# EAGLE schematic wireless (EAGLE 9.2.2)

## Sheet 1 of 3: Microcontroller
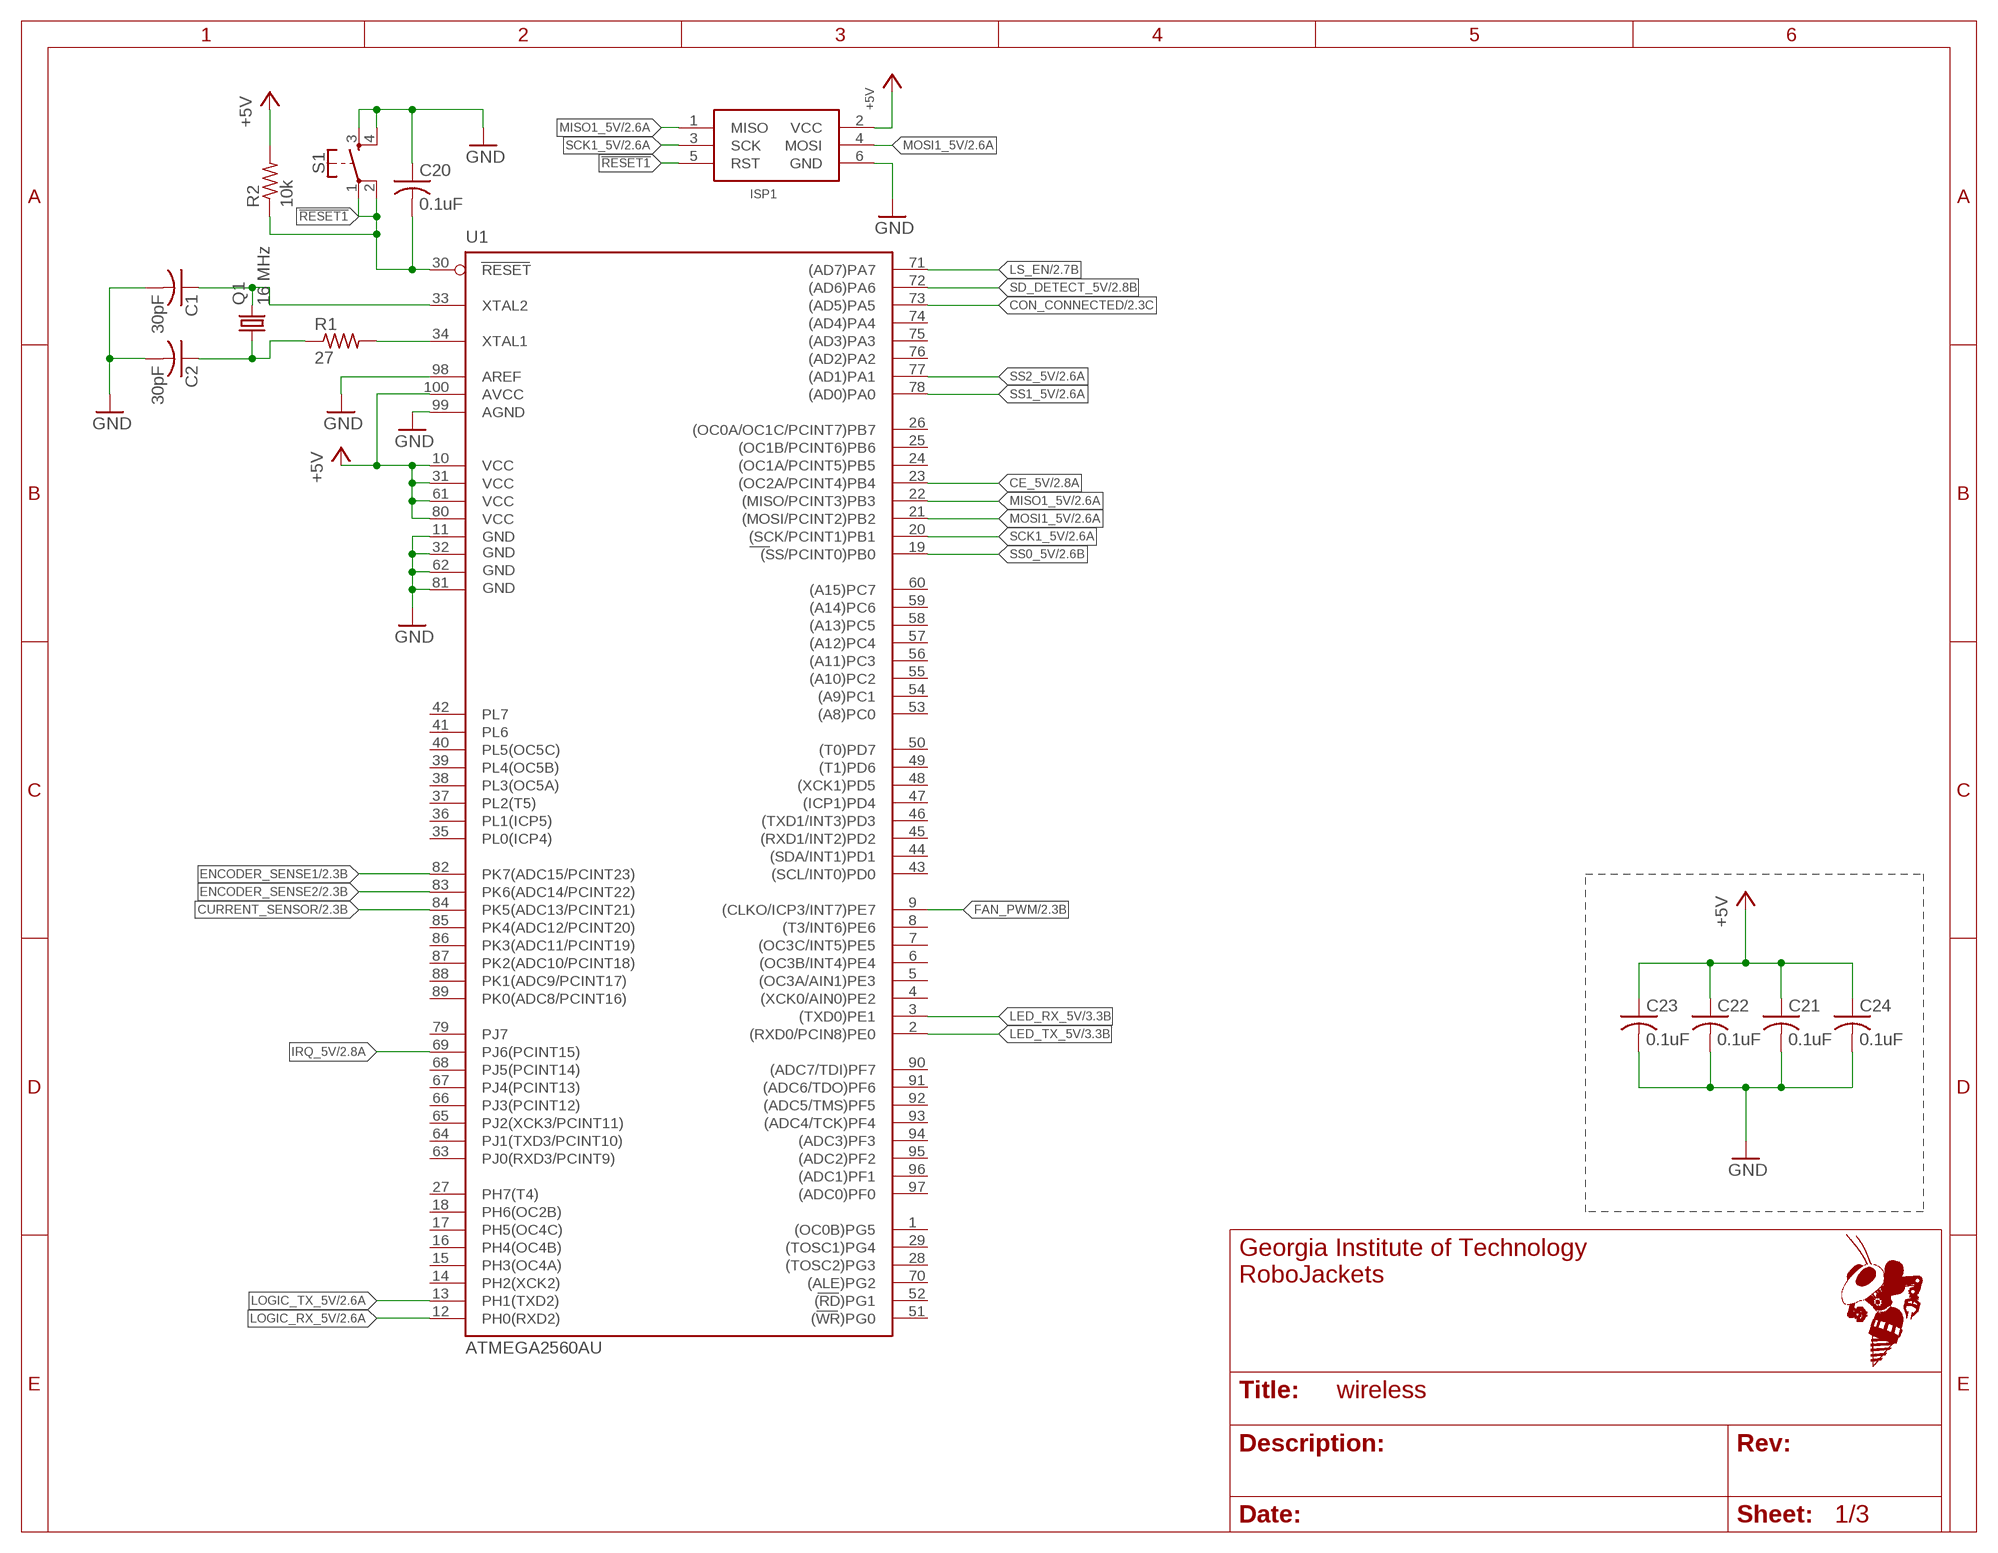
[diagram p0: schematic, sheet 1]

### Parts
C1  30pF  C-USC0603  [C0603]
C2  30pF  C-USC0603  [C0603]
C20  0.1uF  C-USC0603  [C0603]
C21  0.1uF  C-USC0603  [C0603]
C22  0.1uF  C-USC0603  [C0603]
C23  0.1uF  C-USC0603  [C0603]
C24  0.1uF  C-USC0603  [C0603]
ISP1  AVRISP-6  [AVRISP]
Q1  16 MHz  CRYSTALHC49UP  [HC49UP]
R1  27  R-US_R0603  [R0603]
R2  10k  R-US_R0603  [R0603]
S1  MOMENTARY-SWITCH-SPST-2-SMD-5.2MM  [TACTILE_SWITCH_SMD_5.2MM]
U1  ATMEGA2560AU  [TQFP100]

### Nets
!RESET1: C20.2 ISP1.5(RST) R2.1 S1.1 S1.2 U1.30(RESET)
+5V: C21.1 C22.1 C23.1 C24.1 ISP1.2(VCC) R2.2 U1.10(VCC) U1.31(VCC1) U1.61(VCC2) U1.80(VCC3) U1.100(AVCC) ; also sheet 2,3
CE_5V: U1.23((OC2A/PCINT4)PB4) ; also sheet 2
CON_CONNECTED: U1.73((AD5)PA5) ; also sheet 2
CURRENT_SENSOR: U1.84(PK5(ADC13/PCINT21)) ; also sheet 2
ENCODER_SENSE1: U1.82(PK7(ADC15/PCINT23)) ; also sheet 2
ENCODER_SENSE2: U1.83(PK6(ADC14/PCINT22)) ; also sheet 2
FAN_PWM: U1.9((CLKO/ICP3/INT7)PE7) ; also sheet 2
GND: C1.2 C2.2 C20.1 C21.2 C22.2 C23.2 C24.2 ISP1.6(GND) S1.3 S1.4 U1.11(GND) U1.32(GND1) U1.62(GND2) U1.81(GND3) U1.98(AREF) U1.99(AGND) ; also sheet 2,3
IRQ_5V: U1.69(PJ6(PCINT15)) ; also sheet 2
LED_RX_5V: U1.3((TXD0)PE1) ; also sheet 3
LED_TX_5V: U1.2((RXD0/PCIN8)PE0) ; also sheet 3
LOGIC_RX_5V: U1.12(PH0(RXD2)) ; also sheet 2
LOGIC_TX_5V: U1.13(PH1(TXD2)) ; also sheet 2
LS_EN: U1.71((AD7)PA7) ; also sheet 2
MISO1_5V: ISP1.1(MISO) U1.22((MISO/PCINT3)PB3) ; also sheet 2
MOSI1_5V: ISP1.4(MOSI) U1.21((MOSI/PCINT2)PB2) ; also sheet 2
N$1: C2.1 Q1.1 R1.1
N$2: C1.1 Q1.2 U1.33(XTAL2)
N$3: R1.2 U1.34(XTAL1)
SCK1_5V: ISP1.3(SCK) U1.20((SCK/PCINT1)PB1) ; also sheet 2
SD_DETECT_5V: U1.72((AD6)PA6) ; also sheet 2
SS0_5V: U1.19((SS/PCINT0)PB0) ; also sheet 2
SS1_5V: U1.78((AD0)PA0) ; also sheet 2
SS2_5V: U1.77((AD1)PA1) ; also sheet 2
Unconnected: U1.1((OC0B)PG5) U1.4((XCK0/AIN0)PE2) U1.5((OC3A/AIN1)PE3) U1.6((OC3B/INT4)PE4) U1.7((OC3C/INT5)PE5) U1.8((T3/INT6)PE6) U1.14(PH2(XCK2)) U1.15(PH3(OC4A)) U1.16(PH4(OC4B)) U1.17(PH5(OC4C)) U1.18(PH6(OC2B)) U1.24((OC1A/PCINT5)PB5) U1.25((OC1B/PCINT6)PB6) U1.26((OC0A/OC1C/PCINT7)PB7) U1.27(PH7(T4)) U1.28((TOSC2)PG3) U1.29((TOSC1)PG4) U1.35(PL0(ICP4)) U1.36(PL1(ICP5)) U1.37(PL2(T5)) U1.38(PL3(OC5A)) U1.39(PL4(OC5B)) U1.40(PL5(OC5C)) U1.41(PL6) U1.42(PL7) U1.43((SCL/INT0)PD0) U1.44((SDA/INT1)PD1) U1.45((RXD1/INT2)PD2) U1.46((TXD1/INT3)PD3) U1.47((ICP1)PD4) U1.48((XCK1)PD5) U1.49((T1)PD6) U1.50((T0)PD7) U1.51((WR)PG0) U1.52((RD)PG1) U1.53((A8)PC0) U1.54((A9)PC1) U1.55((A10)PC2) U1.56((A11)PC3) U1.57((A12)PC4) U1.58((A13)PC5) U1.59((A14)PC6) U1.60((A15)PC7) U1.63(PJ0(RXD3/PCINT9)) U1.64(PJ1(TXD3/PCINT10)) U1.65(PJ2(XCK3/PCINT11)) U1.66(PJ3(PCINT12)) U1.67(PJ4(PCINT13)) U1.68(PJ5(PCINT14)) U1.70((ALE)PG2) U1.74((AD4)PA4) U1.75((AD3)PA3) U1.76((AD2)PA2) U1.79(PJ7) U1.85(PK4(ADC12/PCINT20)) U1.86(PK3(ADC11/PCINT19)) U1.87(PK2(ADC10/PCINT18)) U1.88(PK1(ADC9/PCINT17)) U1.89(PK0(ADC8/PCINT16)) U1.90((ADC7/TDI)PF7) U1.91((ADC6/TDO)PF6) U1.92((ADC5/TMS)PF5) U1.93((ADC4/TCK)PF4) U1.94((ADC3)PF3) U1.95((ADC2)PF2) U1.96((ADC1)PF1) U1.97((ADC0)PF0)

## Sheet 2 of 3: Connectors
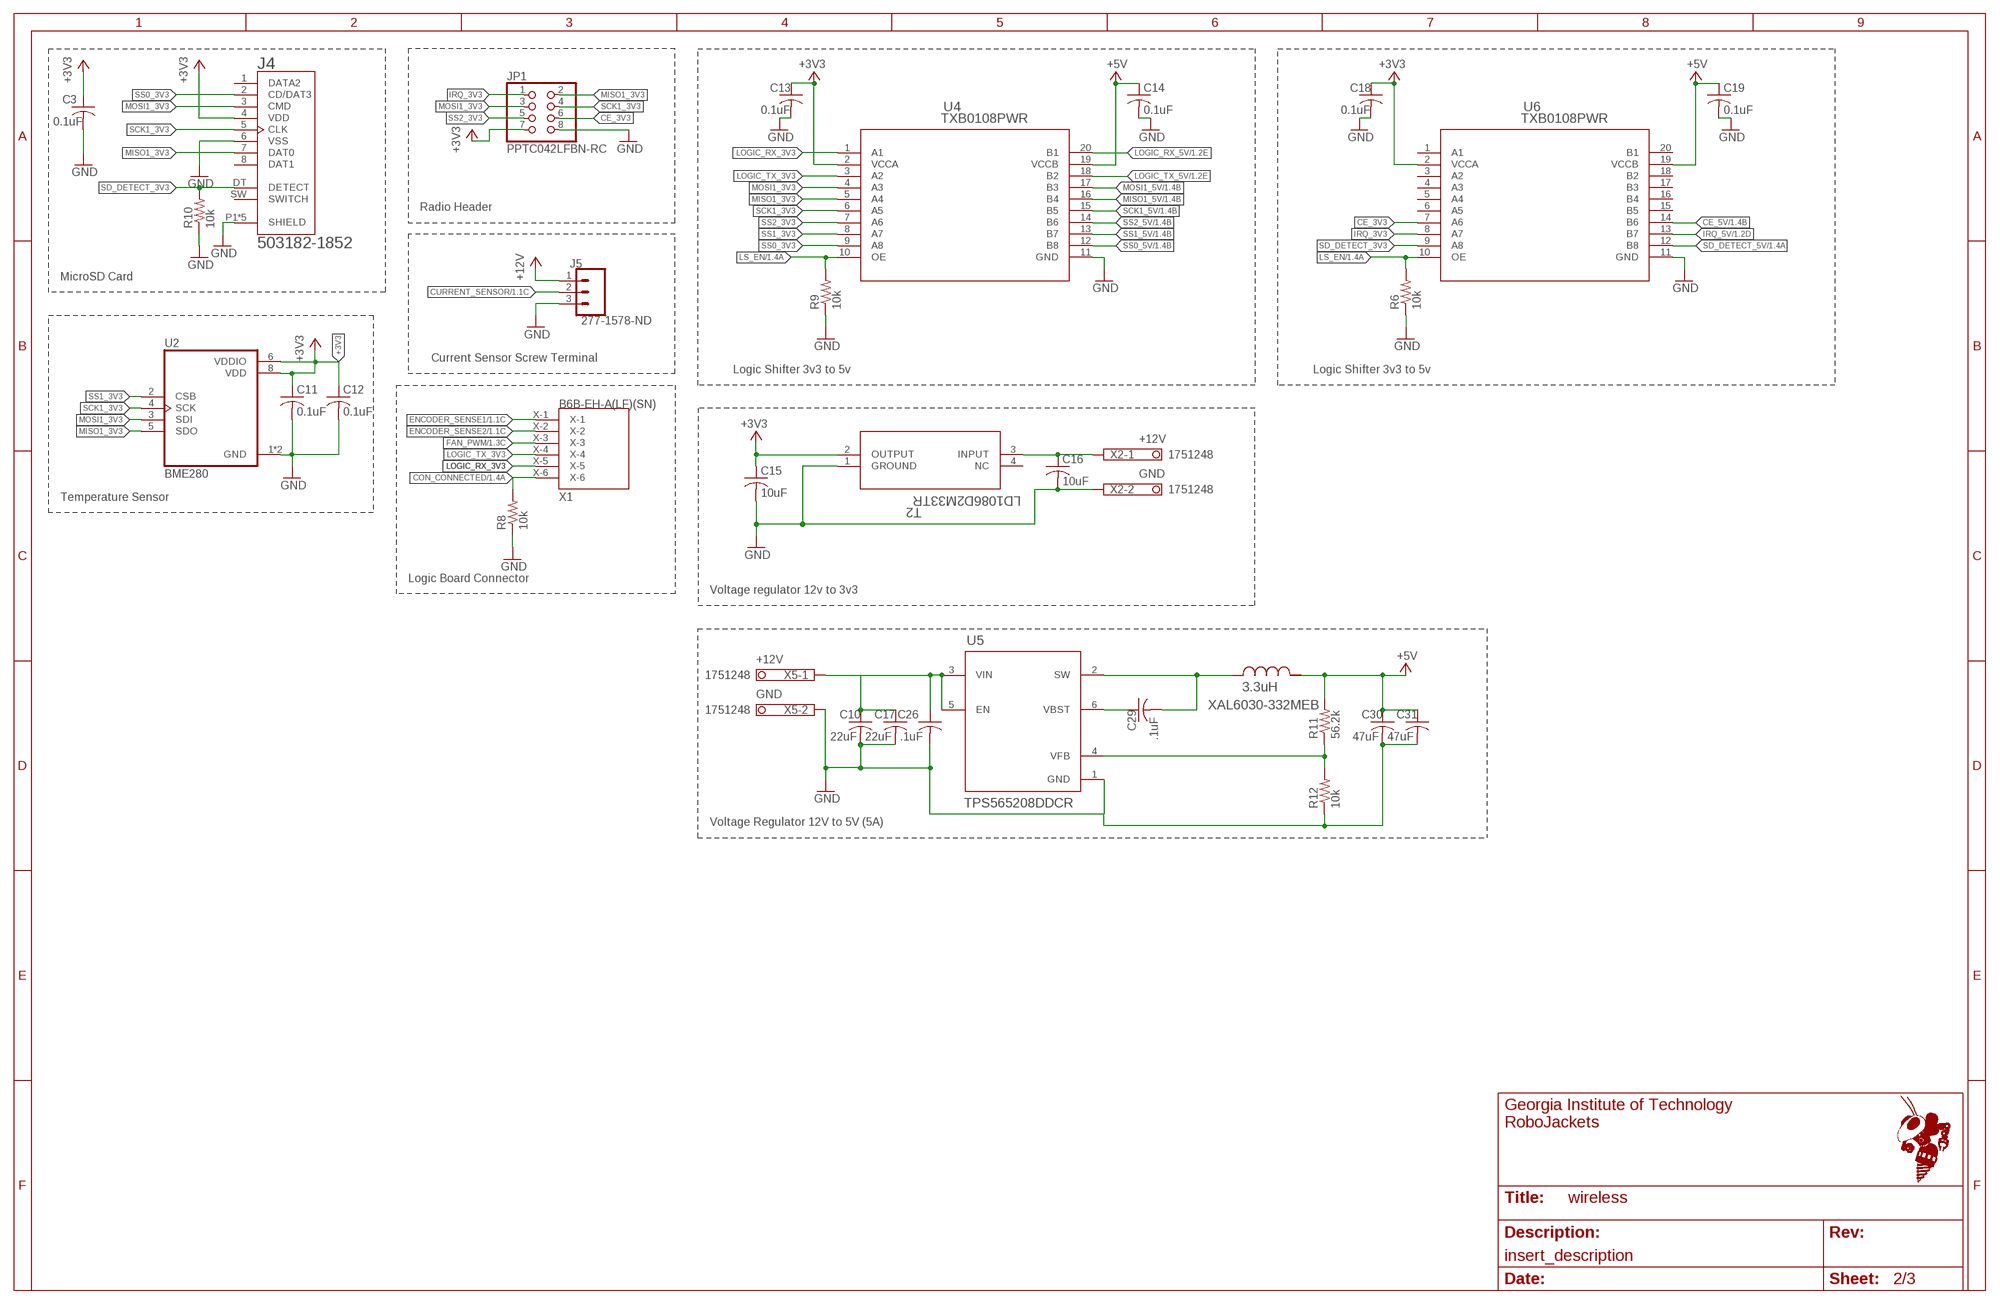
[diagram p1: schematic, sheet 2]
FRAME4 (FRAME_B_L): SCH_DESC: insert_description

### Parts
C3  0.1uF  C-USC0603  [C0603]
C10  22uF  C-USC0603  [C0603]
C11  0.1uF  C-USC0603  [C0603]
C12  0.1uF  C-USC0603  [C0603]
C13  0.1uF  C-USC0603  [C0603]
C14  0.1uF  C-USC0603  [C0603]
C15  10uF  C-USC1206  [C1206]
C16  10uF  C-USC1206  [C1206]
C17  22uF  C-USC0603  [C0603]
C18  0.1uF  C-USC0603  [C0603]
C19  0.1uF  C-USC0603  [C0603]
C26  .1uF  C-USC0603  [C0603]
C29  .1uF  C-USC0603  [C0603]
C30  47uF  C-USC0603  [C0603]
C31  47uF  C-USC0603  [C0603]
J4  503182-1852  [MOLEX_503182-1852]
J5  277-1578-ND  CONN_03-SCREW-5MM  [SCREWTERMINAL-5MM-3]
JP1  PPTC042LFBN-RC  PINHD-2X4  [2X04]
R6  10k  R-US_R0603  [R0603]
R8  10k  R-US_R0603  [R0603]
R9  10k  R-US_R0603  [R0603]
R10  10k  R-US_R0603  [R0603]
R11  56.2k  R-US_R0603  [R0603]
R12  10k  R-US_R0603  [R0603]
T2  LD1086D2M33TR  [D2PAK/A]
U2  BME280  [PSON65P250X250X100-8N]
U4  TXB0108PWR  [PW20]
U5  TPS565208DDCR  [DDC0006A_N]
U6  TXB0108PWR  [PW20]
X1  B6B-EH-A(LF)(SN)  [B6BEHALFSN]
X2  1751248  [1751248]
X5  1751248  [1751248]
XAL6030-332MEB  3.3uH  XAL6030-332MEB  [XAL6030]

### Nets
+3.3V: JP1.7 ; supply symbol labelled +3V3
+3V3: C11.1 C12.1 C13.1 C18.1 J4.4(VDD) U2.6(VDDIO) U2.8(VDD) U4.2(VCCA) U6.2(VCCA)
+5V: C3.1 C14.1 C15.1 C19.1 C30.1 C31.1 R11.2 T2.2(OUTPUT) U4.19(VCCB) U6.19(VCCB) XAL6030-332MEB.2 ; supply symbol labelled +3V3 ; also sheet 1,3
+12V: J5.1
CE_3V3: JP1.6 U6.7(A6)
CE_5V: U6.14(B6) ; also sheet 1
CON_CONNECTED: R8.2 X1.X-6 ; also sheet 1
CURRENT_SENSOR: J5.2 ; also sheet 1
ENCODER_SENSE1: X1.X-1 ; also sheet 1
ENCODER_SENSE2: X1.X-2 ; also sheet 1
FAN_PWM: X1.X-3 ; also sheet 1
GND: C3.2 C10.2 C11.2 C12.2 C13.2 C14.2 C15.2 C16.2 C17.2 C18.2 C19.2 C26.2 C30.2 C31.2 J4.6(VSS) J4.P1(SHIELD) J4.P2(SHIELD) J4.P3(SHIELD) J4.P4(SHIELD) J4.P5(SHIELD) J5.3 JP1.8 R6.1 R8.1 R9.1 R10.1 R12.1 T2.1(GROUND) U2.1(GND) U2.7(GND) U4.11(GND) U5.1(GND) U6.11(GND) X2.2 X5.2 ; also sheet 1,3
IRQ_3V3: JP1.1 U6.8(A7)
IRQ_5V: U6.13(B7) ; also sheet 1
LOGIC_RX_3V3: U4.1(A1) X1.X-5
LOGIC_RX_5V: U4.20(B1) ; also sheet 1
LOGIC_TX_3V3: U4.3(A2) X1.X-4
LOGIC_TX_5V: U4.18(B2) ; also sheet 1
LS_EN: R6.2 R9.2 U4.10(OE) U6.10(OE) ; also sheet 1
MISO1_3V3: J4.7(DAT0) JP1.2 U2.5(SDO) U4.5(A4)
MISO1_5V: U4.16(B4) ; also sheet 1
MOSI1_3V3: J4.3(CMD) JP1.3 U2.3(SDI) U4.4(A3)
MOSI1_5V: U4.17(B3) ; also sheet 1
N$5: C10.1 C17.1 C26.1 U5.3(VIN) U5.5(EN) X5.1
N$7: C29.2 U5.2(SW) XAL6030-332MEB.1
N$8: C29.1 U5.6(VBST)
N$9: R11.1 R12.2 U5.4(VFB)
SCK1_3V3: J4.5(CLK) JP1.4 U2.4(SCK) U4.6(A5)
SCK1_5V: U4.15(B5) ; also sheet 1
SD_DETECT_3V3: J4.DT(DETECT) R10.2 U6.9(A8)
SD_DETECT_5V: U6.12(B8) ; also sheet 1
SS0_3V3: J4.2(CD/DAT3) U4.9(A8)
SS0_5V: U4.12(B8) ; also sheet 1
SS1_3V3: U2.2(CSB) U4.8(A7)
SS1_5V: U4.13(B7) ; also sheet 1
SS2_3V3: JP1.5 U4.7(A6)
SS2_5V: U4.14(B6) ; also sheet 1
V_IN: C16.1 T2.3(INPUT) X2.1
Unconnected: J4.1(DATA2) J4.8(DAT1) J4.SW(SWITCH) T2.4(NC) U6.1(A1) U6.3(A2) U6.4(A3) U6.5(A4) U6.6(A5) U6.15(B5) U6.16(B4) U6.17(B3) U6.18(B2) U6.20(B1)

### Notes on the sheet
- Radio Header
- MicroSD Card
- Current Sensor Screw Terminal
- Logic Shifter 3v3 to 5v | Logic Shifter 3v3 to 5v
- +12V
- GND
- Temperature Sensor
- Logic Board Connector
- Voltage regulator 12v to 3v3
- +12V
- GND
- Voltage Regulator 12V to 5V (5A)

## Sheet 3 of 3: Neopixel
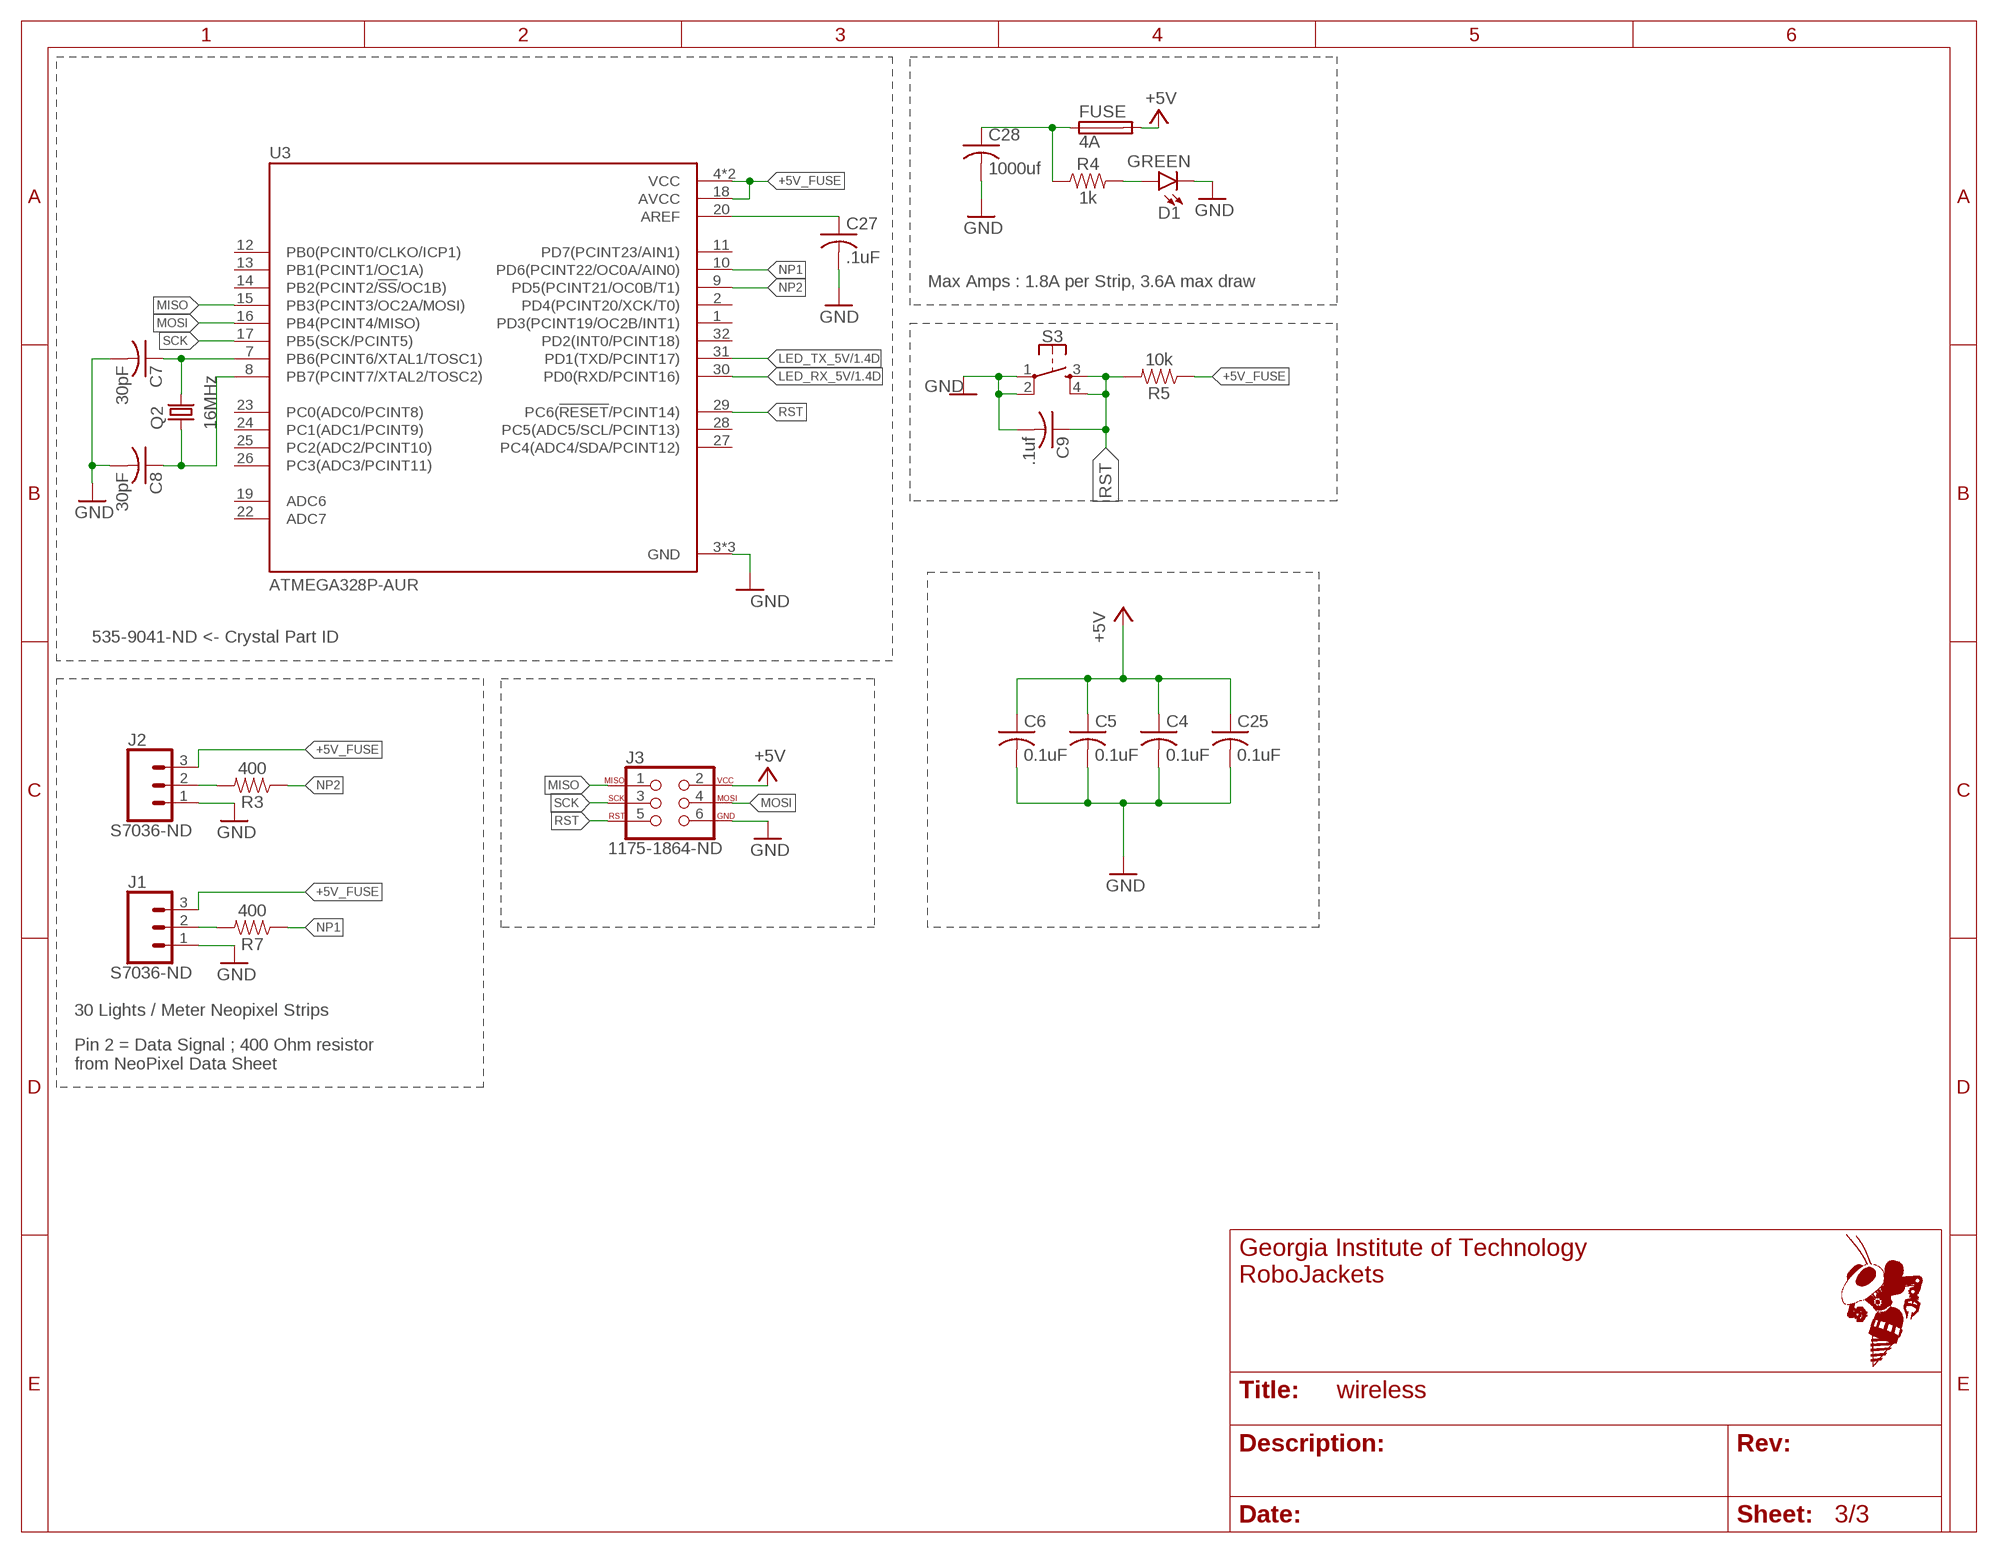
[diagram p2: schematic, sheet 3]

### Parts
C4  0.1uF  C-USC0603  [C0603]
C5  0.1uF  C-USC0603  [C0603]
C6  0.1uF  C-USC0603  [C0603]
C7  30pF  C-USC0603  [C0603]
C8  30pF  C-USC0603  [C0603]
C9  .1uf  C-USC0603  [C0603]
C25  0.1uF  C-USC0603  [C0603]
C27  .1uF  C-USC0603  [C0603]
C28  1000uf  C-USC0603  [C0603]
D1  GREEN  LED-GREEN0603  [LED-0603]
FUSE  4A  FUSE_HOLDER  [FUSE_HOLDER]
J1  S7036-ND  CONN_03  [1X03]
J2  S7036-ND  CONN_03  [1X03]
J3  1175-1864-ND  AVR_SPI_PROG_3X2NS  [2X3-NS]
Q2  16MHz  CRYSTALHC49S  [HC49/S]
R3  400  470OHM-0603-1/10W-1%  [0603]
R4  1k  470OHM-0603-1/10W-1%  [0603]
R5  10k  470OHM-0603-1/10W-1%  [0603]
R7  400  470OHM-0603-1/10W-1%  [0603]
S3  MOMENTARY-SWITCH-SPST-2-SMD-5.2MM  [TACTILE_SWITCH_SMD_5.2MM]
U3  ATMEGA328P-AUR  [QFP32P80_900X900X120L60X37N]

### Nets
+5V: C4.1 C5.1 C6.1 C25.1 FUSE.P$3 FUSE.P$4 J3.2 ; also sheet 1,2
+5V_FUSE: C28.1 FUSE.P$1 FUSE.P$2 J1.3 J2.3 R4.1 R5.1 U3.4(VCC) U3.6(VCC) U3.18(AVCC)
DATA3: J2.2 R3.2
DATA4: J1.2 R7.2
GND: C4.2 C5.2 C6.2 C7.2 C8.2 C9.2 C25.2 C27.2 C28.2 D1.C J1.1 J2.1 J3.6 S3.1 S3.2 U3.3(GND) U3.5(GND) U3.21(GND) ; also sheet 1,2
LED_RX_5V: U3.30(PD0(RXD/PCINT16)) ; also sheet 1
LED_TX_5V: U3.31(PD1(TXD/PCINT17)) ; also sheet 1
MISO: J3.1 U3.15(PB3(PCINT3/OC2A/MOSI))
MOSI: J3.4 U3.16(PB4(PCINT4/MISO))
N$4: D1.A R4.2
N$23: C27.1 U3.20(AREF)
NP1: R7.1 U3.10(PD6(PCINT22/OC0A/AIN0))
NP2: R3.1 U3.9(PD5(PCINT21/OC0B/T1))
RST: C9.1 J3.5 R5.2 S3.3 S3.4 U3.29(PC6(!RESET!/PCINT14))
SCK: J3.3 U3.17(PB5(SCK/PCINT5))
XTAL3: C7.1 Q2.2 U3.7(PB6(PCINT6/XTAL1/TOSC1))
XTAL4: C8.1 Q2.1 U3.8(PB7(PCINT7/XTAL2/TOSC2))
Unconnected: U3.1(PD3(PCINT19/OC2B/INT1)) U3.2(PD4(PCINT20/XCK/T0)) U3.11(PD7(PCINT23/AIN1)) U3.12(PB0(PCINT0/CLKO/ICP1)) U3.13(PB1(PCINT1/OC1A)) U3.14(PB2(PCINT2/!SS!/OC1B)) U3.19(ADC6) U3.22(ADC7) U3.23(PC0(ADC0/PCINT8)) U3.24(PC1(ADC1/PCINT9)) U3.25(PC2(ADC2/PCINT10)) U3.26(PC3(ADC3/PCINT11)) U3.27(PC4(ADC4/SDA/PCINT12)) U3.28(PC5(ADC5/SCL/PCINT13)) U3.32(PD2(INT0/PCINT18))

### Notes on the sheet
- Max Amps : 1.8A per Strip, 3.6A max draw
- 535-9041-ND <- Crystal Part ID
- 30 Lights / Meter Neopixel Strips
- Pin 2 = Data Signal ; 400 Ohm resistor 
  from NeoPixel Data Sheet

## Library data of the parts
C1-C31 = rcl:C-US: CAPACITOR, American symbol; SPICEPREFIX: C
D1 = SparkFun-LED:LED-GREEN: Green SMD LED Used in manufacturing of various products at SparkFun Packages: 0603 - SMD 0603 package [Product Link] <http://www.futureelectronics.com/en/technologies/semiconductors/optoelectronics/leds/Pages/9894312-LTST-C190GKT.aspx?CrossPart=HSMG-C190&IM=0> LilyPad 1206 - SMD1206 LilyPad package [Product Link] <http://www.futureelectronics.com/en/Technologies/Product.aspx?ProductID=IN150NGHARVATEKCORPORATION2049943&IM=0> 1206 - SMD1206 package [Product Link] <http://www.futureelectronics.com/en/technologies/semiconductors/optoelectronics/leds/Pages/8315665-LTST-C150KGKT.aspx?IM=0> 1206 Bottom Mount -SMD 1206 Bottom Mount [Product Link] <http://www.digikey.com/product-detail/en/lite-on-inc/LTST-C230KGKT/160-1456-1-ND/386854> SparkFun Products: Pro Mini 328 -5V <https://www.sparkfun.com/products/821> RedBoard <https://www.sparkfun.com/products/12757> MP3 Trigger <https://www.sparkfun.com/products/13720> Makey Makey <https://www.sparkfun.com/products/11076>; PROD_ID: DIO-00821
FUSE = IGVC-Misc:FUSE_HOLDER
ISP1 = adafruit:AVRISP: AVR ISP HEADER Standard 6 pin header for AVR programming
J1 J2 = SparkFun-Connectors:CONN_03: Multi connection point. Often used as Generic Header-pin footprint for 0.1 inch spaced/style header connections On any of the 0.1 inch spaced packages, you can populate with these: Break Away Headers - Straight <https://www.sparkfun.com/products/116> (PRT-00116) Break Away Male Headers - Right Angle <https://www.sparkfun.com/products/553> (PRT-00553) Female Headers <https://www.sparkfun.com/products/115> (PRT-00115) Break Away Headers - Machine Pin <https://www.sparkfun.com/products/117> (PRT-00117) Break Away Female Headers - Swiss Machine Pin <https://www.sparkfun.com/products/743> (PRT-00743) Stackable Header - 3 Pin (Female, 0.1") <https://www.sparkfun.com/products/13875> (PRT-13875) For SCREWTERMINALS and SPRING TERMINALS visit here: Screw Terimnals on SparkFun.com <https://www.sparkfun.com/search/results?term=Screw+Terminals> (5mm/3.5mm/2.54mm spacing) This device is also useful as a general connection point to wire up your design to another part of your project. Our various solder wires solder well into these plated through hole pads. Hook-Up Wire - Assortment (Stranded, 22 AWG) <https://www.sparkfun.com/products/11375> (PRT-11375) Hook-Up Wire - Assortment (Solid Core, 22 AWG) <https://www.sparkfun.com/products/11367> (PRT-11367) View the entire wire category on our website here <https://www.sparkfun.com/categories/141> Special notes: Molex polarized connector foot print use with SKU : PRT-08232 with associated crimp pins and housings.; SPICEPREFIX: J
J3 = SparkFun-Connectors:AVR_SPI_PROG_3X2: AVR ISP 6 Pin This is the reduced ISP connector for AVR programming. Common on Arduino. This footprint will take up less PCB space and can be used with a 10-pin to 6-pin adapter such as SKU: BOB-08508 **Special note about "TEST_POINT" package. The stop mask is on the top side, so if you want your programming test points to be on the bottom of your board, make sure to place this package on the bottom side of the board. This also ensure that the orientation to program from the bottom side will be correct. SparkFun Products: SparkFun ISP Pogo Adapter <https://www.sparkfun.com/products/11591> - NS Tiny AVR Programmer <https://www.sparkfun.com/products/11801> -PTH
J4 = 503182-1852:503182-1852: Conn Micro SD Card M 8 POS 1.09mm Solder RA SMD Embossed T/R 0.5A/Contact; AVAILABILITY: Unavailable; DESCRIPTION: MICRO SD NORMAL ULTRALOWPRO8CKTE; MF: Molex; MP: 5031821852; PACKAGE: None; PRICE: None
J5 = SparkFun-Connectors:CONN_03: Multi connection point. Often used as Generic Header-pin footprint for 0.1 inch spaced/style header connections On any of the 0.1 inch spaced packages, you can populate with these: Break Away Headers - Straight <https://www.sparkfun.com/products/116> (PRT-00116) Break Away Male Headers - Right Angle <https://www.sparkfun.com/products/553> (PRT-00553) Female Headers <https://www.sparkfun.com/products/115> (PRT-00115) Break Away Headers - Machine Pin <https://www.sparkfun.com/products/117> (PRT-00117) Break Away Female Headers - Swiss Machine Pin <https://www.sparkfun.com/products/743> (PRT-00743) Stackable Header - 3 Pin (Female, 0.1") <https://www.sparkfun.com/products/13875> (PRT-13875) For SCREWTERMINALS and SPRING TERMINALS visit here: Screw Terimnals on SparkFun.com <https://www.sparkfun.com/search/results?term=Screw+Terminals> (5mm/3.5mm/2.54mm spacing) This device is also useful as a general connection point to wire up your design to another part of your project. Our various solder wires solder well into these plated through hole pads. Hook-Up Wire - Assortment (Stranded, 22 AWG) <https://www.sparkfun.com/products/11375> (PRT-11375) Hook-Up Wire - Assortment (Solid Core, 22 AWG) <https://www.sparkfun.com/products/11367> (PRT-11367) View the entire wire category on our website here <https://www.sparkfun.com/categories/141> Special notes: Molex polarized connector foot print use with SKU : PRT-08232 with associated crimp pins and housings.; PROD_ID: CONN-10134; SF_SKU: PRT-08433
JP1 = pinhead:PINHD-2X4: PIN HEADER
Q1 = adafruit:CRYSTAL: CRYSTAL; OC_FARNELL: unknown; OC_NEWARK: unknown
Q2 = crystal:CRYSTAL: CRYSTAL; OC_FARNELL: 1667008; OC_NEWARK: unknown
R1 R2 R6 R8-R12 = rcl:R-US_: RESISTOR, American symbol; SPICEPREFIX: R
R3-R5 R7 = SparkFun-Resistors:470OHM: 470Ω resistor A resistor is a passive two-terminal electrical component that implements electrical resistance as a circuit element. Resistors act to reduce current flow, and, at the same time, act to lower voltage levels within circuits. - Wikipedia; PROD_ID: RES-07869; VALUE: 470
S1 S3 = SparkFun-Switches:MOMENTARY-SWITCH-SPST-2: Momentary Switch (Pushbutton) - SPST - Two Circuits Normally-open (NO) SPST momentary switches (buttons, pushbuttons). Schematic symbol includes two switch circuits. Variants SMD-4.6MMX2.8MM - 4.60mm x 2.80mm Tactile Momentary Button Switch - Used on SparkFun SAMD21 Mini Breakout <https://www.sparkfun.com/products/13664> SMD-5.2MM - Mini Pushbutton Switch - SMD <https://www.sparkfun.com/products/8720> - Used on Arduino Pro Mini <https://www.sparkfun.com/products/11114>; PROD_ID: SWCH-08247; SF_SKU: COM-08720
T2 = transistor:LD1086D2M33TR; MANUFACTURER_PART_NUMBER: LD1086D2M33TR; VENDOR: STMicroelectronics
U1 = SparkFun-IC-Microcontroller:ATMEGA2560: Atmel 100-pin 8-bit uC 64/128/256 Kbytes FLASH 4 Kbytes EEPROM 8 Kbytes SRAM 86 General Purpose I/O pins 12-channels16-bit PWM 4 x Serial USARTs 16-channels 10-bit A/D SparkFun Products None.; PROD_ID: IC-10040
U2 = BME280:BME280: DIGITAL HUMIDITY, PRESSURE AND TEMPERATURE SENSOR * Digital interface I²C (up to 3.4 MHz) and SPI (3 and 4 wire, up to 10 MHz)* Supply voltage VDD main supply voltage range: 1.71 V to 3.6 V*VDDIO interface voltage range: 1.2 V to 3.6 V Operating range -40…+85 °C, 0…100 % rel. humidity, 300…1100 hPa The library has been designed by Richard Magdycz <https://www.facebook.com/groups/eaglecadsoftUK>; DESCRIPTION: Integrated pressure, humidity and temperature sensor; 8-pin 2.5x2.5x0.93mm LGA; DIGI-KEY_PART_NUMBER: 828-1063-1-ND; DIGI-KEY_PURCHASE_URL: https://www.digikey.com/product-detail/en/bosch-sensortec/BME280/828-1063-1-ND/6136314?utm_source=snapeda&utm_medium=aggregator&utm_campaign=symbol; MF: Bosch; MP: BME280; PACKAGE: LGA-8 Bosch
U3 = ATMEGA328P-AUR:ATMEGA328P-AUR: ATmega328P Series 8 Bit 2 kB RAM 32 kB Flash SMT Microcontroller - TQFP-32; DESCRIPTION: ATmega328P Series 8 Bit 2 kB RAM 32 kB Flash SMT Microcontroller - TQFP-32; DIGI-KEY_PART_NUMBER: ATMEGA328P-AURCT-ND; DIGI-KEY_PURCHASE_URL: https://www.digikey.com/product-detail/en/microchip-technology/ATMEGA328P-AUR/ATMEGA328P-AURCT-ND/3789455?utm_source=snapeda&utm_medium=aggregator&utm_campaign=symbol; MF: Microchip; MP: ATMEGA328P-AUR; PACKAGE: TQFP-32 Microchip
U4 U6 = 296-21527-1-ND:TXB0108PWR; MANUFACTURER_PART_NUMBER: TXB0108PWR; VENDOR: Texas Instruments
U5 = TPS565208DDCR:TPS565208DDCR; MANUFACTURER: Texas Instruments; MANUFACTURER_NAME: Texas Instruments; MANUFACTURER_PART_NUMBER: TPS565208DDCR; PARTNUMBER: TPS565208DDCR; REFDES: RefDes; TYPE: TYPE; VALUE: Value
X1 = IGVC-Connector:B6B-EH-A(LF)(SN)
X2 X5 = con-phoenix-350:1751248: MKDS 1/ 2-3,5 Printklemme Nennstrom: 10 A Bemessungsspannung: 160 V Raster: 3,5 mm Polzahl: 2 Montageart: Löten Anschlussart: Schraubanschluss Anschlussrichtung vom Leiter zur Platine: 0° Source: http://eshop.phoenixcontact.com .. 1751248.pdf; OC_FARNELL: unknown; OC_NEWARK: unknown
XAL6030-332MEB = TPS565208DDCR:XAL6030-332MEB; DCR: 0.02; IDC: 9.8; L: 3.3E6; MANUFACTURER_NAME: Coilcraft; MANUFACTURER_PART_NUMBER: XAL6030332MEB; VENDOR: Coilcraft